# Altium schematic sheet 2 - Communication.SchDoc: Atmel Energy Metering Demo Board
size A3; DrawnBy: Felix Yao; Organization: Smart Energy; Revision: 1.0; SheetNumber: 2; SheetTotal: 3; PageSetup: Record=PageOptions|CenterHorizontal=True|CenterVertical=True|PrintScale=0.71|XCorrection=1.00|YCorrection=1.00|PrintKind=1|BorderSize=5000000|LeftOffset=0|BottomOffset=0|Orientation=2|PaperLength=1000|PaperWidth=1000|Scale=100|PaperSource=7|PrintQuality=-4|MediaType=1|DitherType=10|PaperKind=A4 (210 x 297 mm)|PrintScaleMode=1
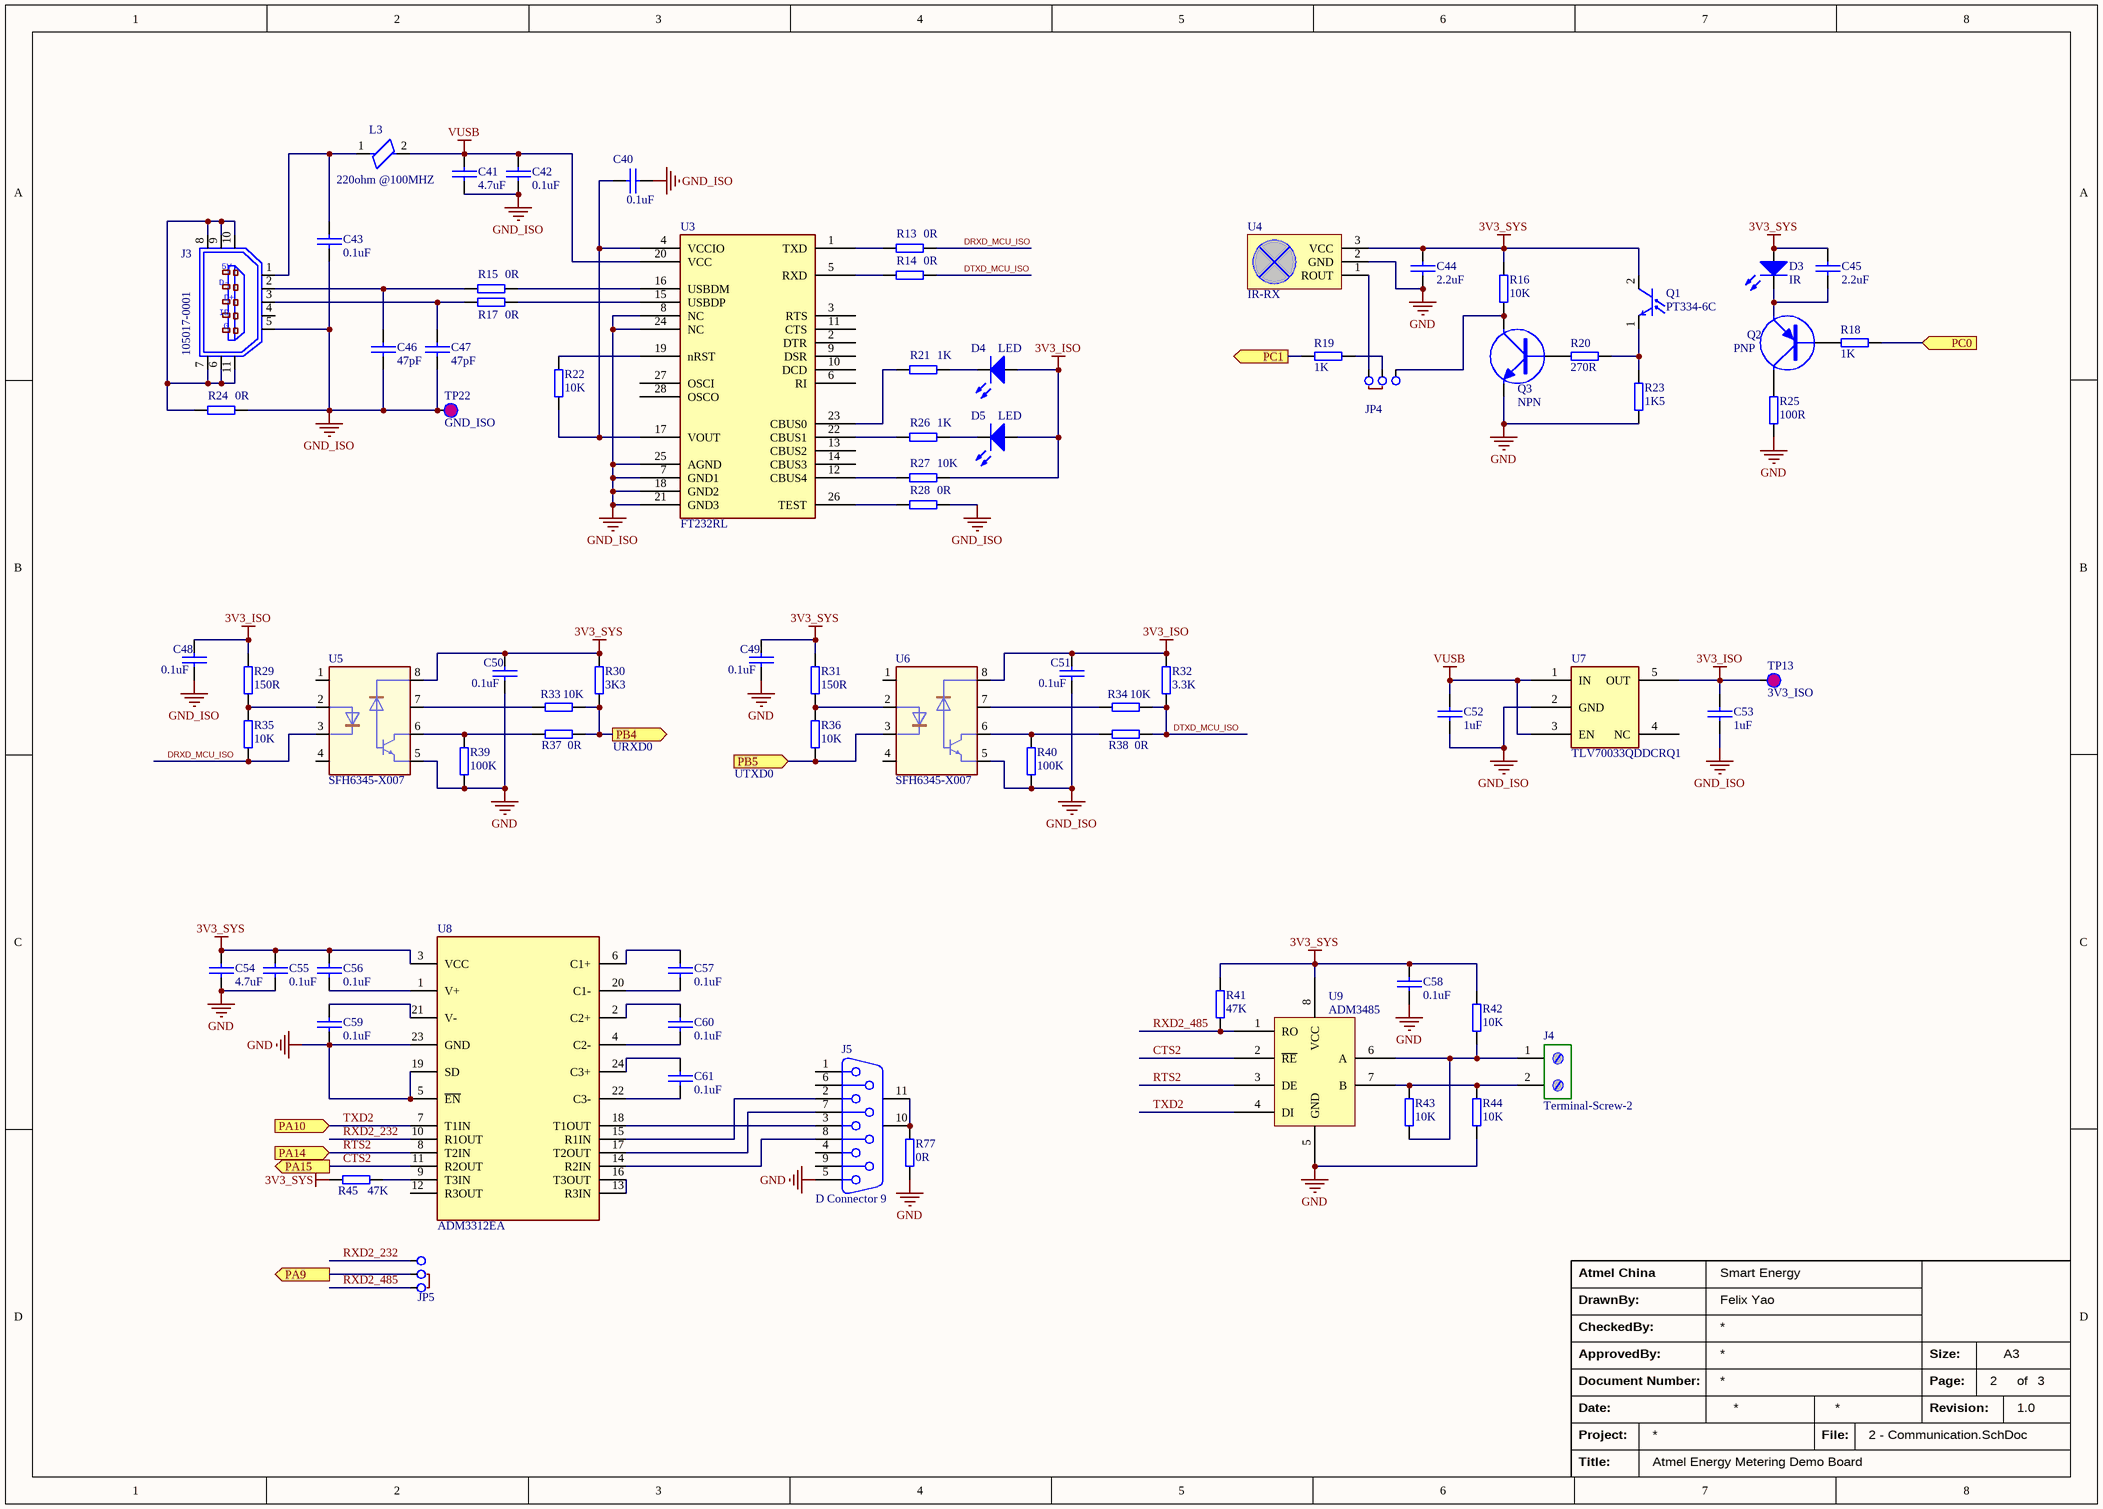
[diagram p0: 2 - Communication.SchDoc]

## Parts
C40  0.1uF  [C0603]
C41  4.7uF  [C0805]
C42  0.1uF  [C0603]
C43  0.1uF  [C0603]
C44  2.2uF  [C0805]
C45  2.2uF  [C0805]
C46  47pF  [C0603]
C47  47pF  [C0603]
C48  0.1uF  [C0603]
C49  0.1uF  [C0603]
C50  0.1uF  [C0603]
C51  0.1uF  [C0603]
C52  1uF  [C0805]
C53  1uF  [C0805]
C54  4.7uF  [C0805]
C55  0.1uF  [C0603]
C56  0.1uF  [C0603]
C57  0.1uF  [C0603]
C58  0.1uF  [C0603]
C59  0.1uF  [C0603]
C60  0.1uF  [C0603]
C61  0.1uF  [C0603]
D3  IR  [LED-5mm]
D4  LED  [LED-0805]
D5  LED  [LED-0805]
J3  105017-0001  [micro_usb_dip_b]
J4  Terminal-Screw-2  [TE-1776119-2]
J5  D Connector 9  [DSUB1.385-2H9]
JP4  JMP3  [JMP3]  (value not drawn)
JP5  JMP3  [JMP3]  (value not drawn)
L3  220ohm @100MHZ  [0805]
Q1  PT334-6C  [LED-DIP-100]
Q2  PNP  [SOT-23]
Q3  NPN  [SOT-23]
R13  0R  [R0603]
R14  0R  [R0603]
R15  0R  [R0603]
R16  10K  [R0603]
R17  0R  [R0603]
R18  1K  [R0603]
R19  1K  [R0603]
R20  270R  [R0603]
R21  1K  [R0603]
R22  10K  [R0603]
R23  1K5  [R0603]
R24  0R  [R0603]
R25  100R  [R0603]
R26  1K  [R0603]
R27  10K  [R0603]
R28  0R  [R0603]
R29  150R  [R0603]
R30  3K3  [R0603]
R31  150R  [R0603]
R32  3.3K  [R0603]
R33  10K  [R0603]
R34  10K  [R0603]
R35  10K  [R0603]
R36  10K  [R0603]
R37  0R  [R0603]
R38  0R  [R0603]
R39  100K  [R0603]
R40  100K  [R0603]
R41  47K  [R0603]
R42  10K  [R0603]
R43  10K  [R0603]
R44  10K  [R0603]
R45  47K  [R0603]
R77  0R  [R0603]
TP13  3V3_ISO  [TP]
TP22  GND_ISO  [TP]
U3  FT232RL  [SSOP-28]
U4  IR-RX  [IR-Rx]
U5  SFH6345-X007  [SO08-400]
U6  SFH6345-X007  [SO08-400]
U7  TLV70033QDDCRQ1  [SOT23-5]
U8  ADM3312EA  [TSSOP-24]
U9  ADM3485  [SOP-8]

## Ports
PA9 (out), PA10 (in), PA14 (in), PA15 (out), PB4 (out), PB5 (in), PC0 (in), PC1 (out)

## Nets
3V3_ISO: C48.2 C51.2 C53.2 D4.A D5.A R27.2 R29.2 R32.2 TP13.1 U6.8 U7.5(OUT)
3V3_SYS: C44.2 C45.2 C49.2 C50.2 C54.2 C55.1 C56.2 C58.1 D3.A Q1.2(C) R16.2 R30.2 R31.2 R41.1 R42.2 R45.2 U4.3(VCC) U5.8 U8.3(VCC) U9.8(VCC)
GND: C44.1 C49.1 C50.1 C54.1 C55.2 C58.2 C59.1 J5.5 Q3.2(E) R23.1 R25.1 R39.1 R44.1 R77.1 U4.2(GND) U5.5 U8.5(~{EN}) U8.19(SD) U8.23(GND) U9.5(GND)
GND_ISO: C40.1 C41.1 C42.1 C43.1 C46.1 C47.1 C48.1 C51.1 C52.1 C53.1 J3.5 R24.2 R28.2 R40.1 TP22.1 U3.7(GND1) U3.8(NC) U3.18(GND2) U3.21(GND3) U3.24(NC) U3.25(AGND) U6.5 U7.2(GND)
VUSB: C41.2 C42.2 C52.2 L3.2 U3.20(VCC) U7.1(IN) U7.3(EN)
CTS2: U8.11(R2OUT) U9.2(~{RE}) ; port PA15
DRXD_MCU_ISO: R13.2 R35.1 U5.3
DTXD_MCU_ISO: R14.2 R32.1 R34.1 R38.1
PA9: JP5.2 ; port PA9
PB4: R30.1 R33.1 R37.1 ; port PB4
PB5: R36.1 U6.3 ; port PB5
PC0: R18.1 ; port PC0
PC1: R19.1 ; port PC1
RTS2: U8.8(T2IN) U9.3(DE) ; port PA14
RXD2_232: JP5.3 U8.10(R1OUT)
RXD2_485: JP5.1 R41.2 U9.1(RO)
TXD2: U8.7(T1IN) U9.4(DI) ; port PA10
NetC40_2: C40.2 R22.1 U3.4(VCCIO) U3.17(VOUT)
NetC43_2: C43.2 J3.1 L3.1
NetC45_1: C45.1 D3.K Q2.2(E)
NetC46_2: C46.2 J3.2 R15.1
NetC47_2: C47.2 J3.3 R17.1
NetC56_1: C56.1 U8.1(V+)
NetC57_1: C57.1 U8.20(C1-)
NetC57_2: C57.2 U8.6(C1+)
NetC59_2: C59.2 U8.21(V-)
NetC60_1: C60.1 U8.4(C2-)
NetC60_2: C60.2 U8.2(C2+)
NetC61_1: C61.1 U8.22(C3-)
NetC61_2: C61.2 U8.24(C3+)
NetD4_K: D4.K R21.2
NetD5_K: D5.K R26.2
NetJ3_6: J3.6 J3.7 J3.8 J3.9 J3.10 J3.11 R24.1
NetJ4_1: J4.1 R42.1 R43.1 U9.6(A)
NetJ4_2: J4.2 R43.2 R44.2 U9.7(B)
NetJ5_2: J5.2 U8.15(R1IN)
NetJ5_3: J5.3 U8.18(T1OUT)
NetJ5_7: J5.7 U8.17(T2OUT)
NetJ5_8: J5.8 U8.14(R2IN)
NetJ5_10: J5.10(MH1) J5.11(MH2) R77.2
NetJP4_1: JP4.1 U4.1(ROUT)
NetJP4_2: JP4.2 R19.2
NetJP4_3: JP4.3 Q3.3(C) R16.1
NetQ1_1: Q1.1(E) R20.2 R23.2
NetQ2_1: Q2.1(B) R18.2
NetQ2_3: Q2.3(C) R25.2
NetQ3_1: Q3.1(B) R20.1
NetR13_1: R13.1 U3.1(TXD)
NetR14_1: R14.1 U3.5(RXD)
NetR15_2: R15.2 U3.16(USBDM)
NetR17_2: R17.2 U3.15(USBDP)
NetR21_1: R21.1 U3.23(CBUS0)
NetR22_2: R22.2 U3.19(nRST)
NetR26_1: R26.1 U3.22(CBUS1)
NetR27_1: R27.1 U3.12(CBUS4)
NetR28_1: R28.1 U3.26(TEST)
NetR29_1: R29.1 R35.2 U5.2
NetR31_1: R31.1 R36.2 U6.2
NetR33_2: R33.2 U5.7
NetR34_2: R34.2 U6.7
NetR37_2: R37.2 R39.2 U5.6
NetR38_2: R38.2 R40.2 U6.6
NetR45_1: R45.1 U8.9(T3IN)
NetU8_13: U8.13(R3IN) U8.16(T3OUT)

Not connected (* = marked no-connect by the designer): J3 4; J5 1 4 6 9; U3 2(DTR) 3(RTS) 6(RI) 9(DSR) 10(DCD) 11(CTS) 13(CBUS2) 14(CBUS3) 27(OSCI) 28(OSCO); U5 1 4; U6 1 4; U7 4(NC); U8 12(R3OUT)

## Notes on the sheet
- URXD0
- UTXD0
- Atmel China
- DrawnBy:
- Document Number:
- CheckedBy:
- ApprovedBy:
- Page:
- Size:
- A3
- of
- Project:
- Date:
- File:
- Revision:
- Title:
- (in symbol 1981584-1_0) 5V; D-; D+; ID; G

## Library data of the parts
C40-C61 = CAP
D3 = LED
J3 = 1981584-1_0: MicroUSB B port,5 Position,Right Angle,Gold Flash 1u; Manufacturer: Molex; Manufacturer Part number: 105017-0001; Value: 105017-0001
J5 = D Connector 9: Receptacle Assembly, 9 Position, Right Angle; PackageDocument: O; Positions: 9; Published: 15-Jun-2001; LatestRevisionDate: 17-Jul-2002; LatestRevisionNote: Re-released for DXP Platform.; DatasheetDocument: 1-Sep-1999; PackageReference: 788750; Publisher: Altium Limited; Orientation: Right Angle; Gender: Receptacle
L3 = BEAD_ FERRITE: Ferrite Bead,470OHM@100MHz,+/-25%,  200mA,; Manufacturer: Murata; Manufacturer Part number: BLM21BD471SN1; Value: 220ohm @100MHZ
Q1 = QSB363CZR_0: PT334-6C；EVERLIGHT;; Manufacturer: Everlight; Manufacturer Part number: PT334-6C; Value: PT334-6C
R13-R45 R77 = RES
TP13 TP22 = TEST-POINT
U3 = FT232RL_2: IC,USB to serial UART interface; Manufacturer: FTDI; Manufacturer Part number: FT232RL-REEL; Value: FT232RL
U5 U6 = SFH6345-X007: IC,High Speed Optocoupler 1Mbd 15kV/μs CMR Transistor Output; Manufacturer: Vishay; Manufacturer Part number: SFH6345-X007; Value: SFH6345-X007
U7 = TLV70033: IC,200-mA  Low-IQ Low-Dropout Regulator; Manufacturer: TI; Manufacturer Part number: TLV70033QDDCR; Value: TLV70033QDDCRQ1
U9 = TI3485